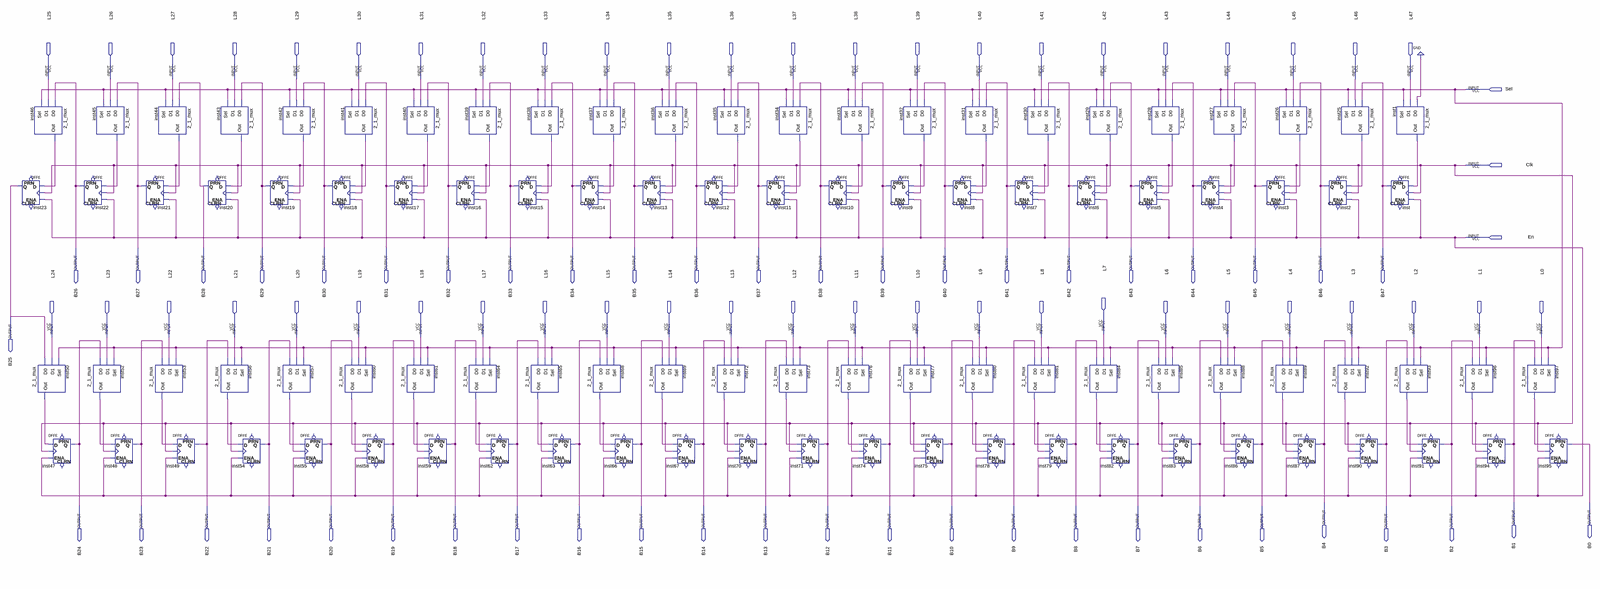
[diagram p0: schematic sheet, whole]
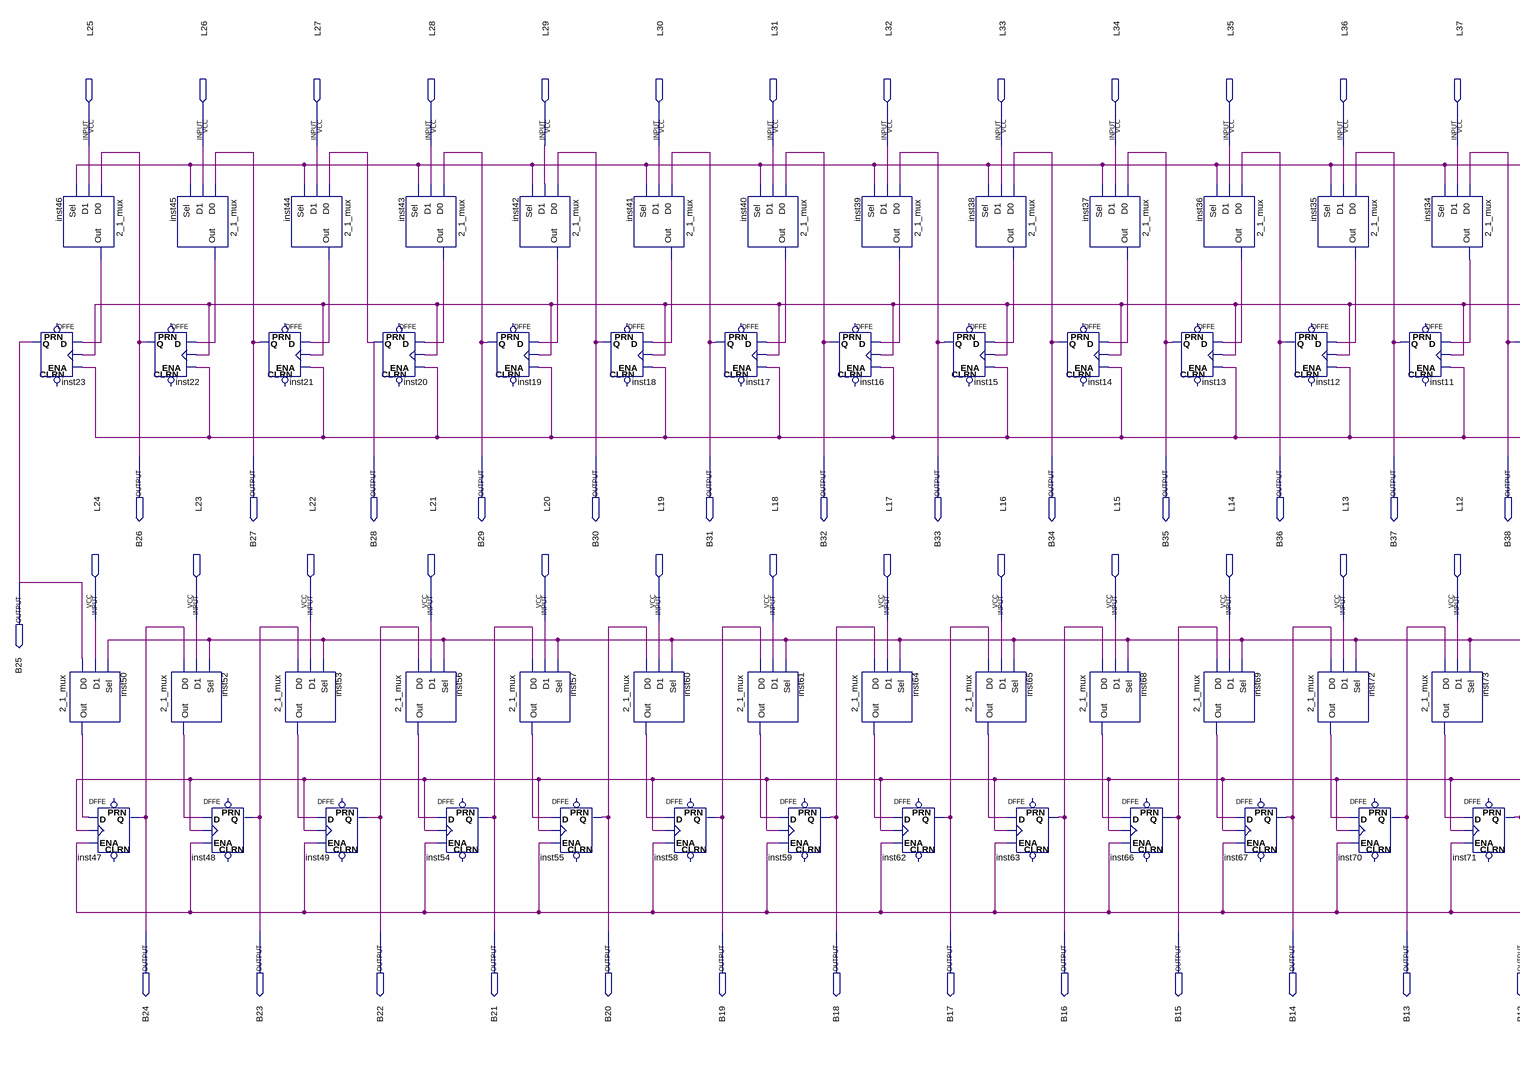
[diagram p1: schematic sheet, left part]
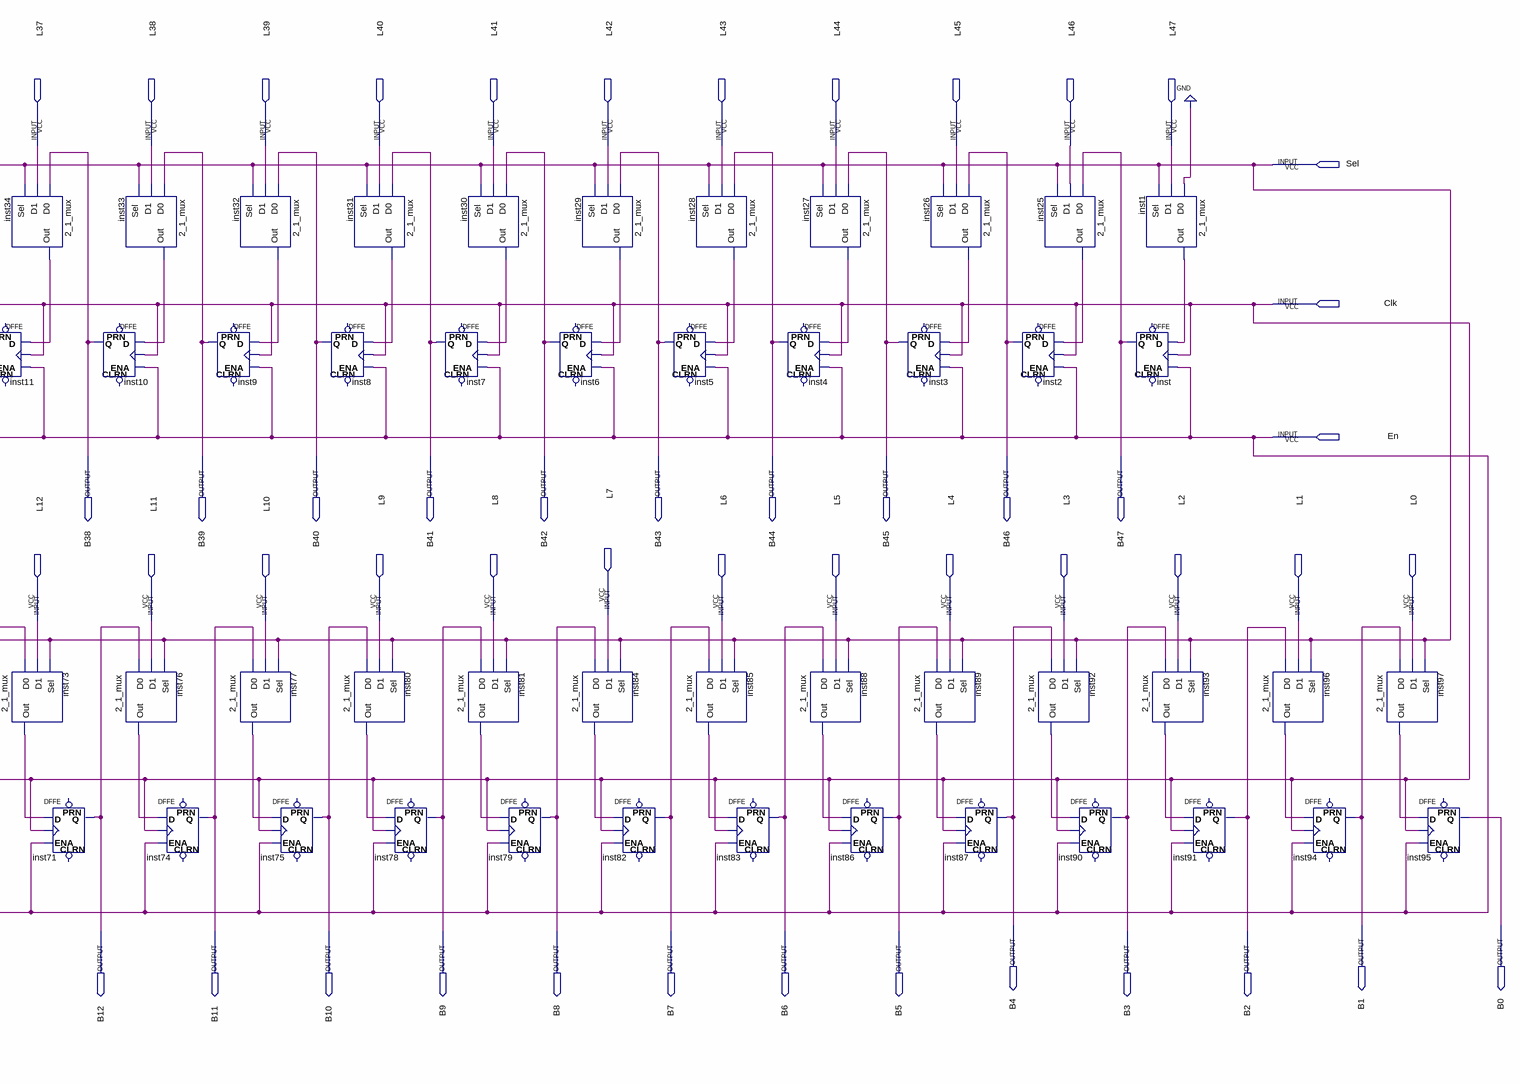
[diagram p2: schematic sheet, right part]
// Quartus schematic 48_bit_par_in_ser_par_out_reg_r.bdf as structural Verilog: 96 symbols, 99 pins
module \48_bit_par_in_ser_par_out_reg_r  (
  input  L25,
  input  L26,
  input  L27,
  input  L28,
  input  L29,
  input  L30,
  input  L31,
  input  L32,
  input  L33,
  input  L34,
  input  L35,
  input  L36,
  input  L37,
  input  L38,
  input  L39,
  input  L40,
  input  L41,
  input  L42,
  input  L43,
  input  L44,
  input  L45,
  input  L46,
  input  L47,
  input  Sel,
  input  Clk,
  input  En,
  input  L7,
  input  L24,
  input  L23,
  input  L22,
  input  L21,
  input  L20,
  input  L19,
  input  L18,
  input  L17,
  input  L16,
  input  L15,
  input  L14,
  input  L13,
  input  L12,
  input  L11,
  input  L10,
  input  L9,
  input  L8,
  input  L6,
  input  L5,
  input  L4,
  input  L3,
  input  L2,
  input  L1,
  input  L0,
  output B26,
  output B27,
  output B28,
  output B29,
  output B30,
  output B31,
  output B32,
  output B33,
  output B34,
  output B35,
  output B36,
  output B37,
  output B38,
  output B39,
  output B40,
  output B41,
  output B42,
  output B43,
  output B44,
  output B45,
  output B46,
  output B47,
  output B25,
  output B4,
  output B1,
  output B0,
  output B24,
  output B23,
  output B22,
  output B21,
  output B20,
  output B19,
  output B18,
  output B17,
  output B16,
  output B15,
  output B14,
  output B13,
  output B12,
  output B11,
  output B10,
  output B9,
  output B8,
  output B7,
  output B6,
  output B5,
  output B3,
  output B2
);

  wire inst1_out, inst25_out, inst26_out, inst27_out, inst28_out, inst29_out, inst30_out, inst31_out,
       inst32_out, inst33_out, inst34_out, inst35_out, inst36_out, inst37_out, inst38_out, inst39_out,
       inst40_out, inst41_out, inst42_out, inst43_out, inst44_out, inst45_out, inst46_out, inst50_out,
       inst52_out, inst53_out, inst56_out, inst57_out, inst60_out, inst61_out, inst64_out, inst65_out,
       inst68_out, inst69_out, inst72_out, inst73_out, inst76_out, inst77_out, inst80_out, inst81_out,
       inst84_out, inst85_out, inst88_out, inst89_out, inst92_out, inst93_out, inst96_out, inst97_out;

  DFFE inst23 (.D(inst46_out), .CLK(Clk), .ENA(En), .Q(B25));  // open: PRN, CLRN
  \2_1_mux  inst46 (.D0(B26), .D1(L25), .Sel(Sel), .Out(inst46_out));
  \2_1_mux  inst50 (.D0(B25), .D1(L24), .Sel(Sel), .Out(inst50_out));
  DFFE inst47 (.D(inst50_out), .CLK(Clk), .ENA(En), .Q(B24));  // open: PRN, CLRN
  DFFE inst22 (.D(inst45_out), .CLK(Clk), .ENA(En), .Q(B26));  // open: PRN, CLRN
  \2_1_mux  inst45 (.D0(B27), .D1(L26), .Sel(Sel), .Out(inst45_out));
  \2_1_mux  inst52 (.D0(B24), .D1(L23), .Sel(Sel), .Out(inst52_out));
  DFFE inst48 (.D(inst52_out), .CLK(Clk), .ENA(En), .Q(B23));  // open: PRN, CLRN
  \2_1_mux  inst44 (.D0(B28), .D1(L27), .Sel(Sel), .Out(inst44_out));
  DFFE inst21 (.D(inst44_out), .CLK(Clk), .ENA(En), .Q(B27));  // open: PRN, CLRN
  \2_1_mux  inst53 (.D0(B23), .D1(L22), .Sel(Sel), .Out(inst53_out));
  DFFE inst49 (.D(inst53_out), .CLK(Clk), .ENA(En), .Q(B22));  // open: PRN, CLRN
  \2_1_mux  inst43 (.D0(B29), .D1(L28), .Sel(Sel), .Out(inst43_out));
  DFFE inst20 (.D(inst43_out), .CLK(Clk), .ENA(En), .Q(B28));  // open: PRN, CLRN
  \2_1_mux  inst56 (.D0(B22), .D1(L21), .Sel(Sel), .Out(inst56_out));
  DFFE inst54 (.D(inst56_out), .CLK(Clk), .ENA(En), .Q(B21));  // open: PRN, CLRN
  DFFE inst19 (.D(inst42_out), .CLK(Clk), .ENA(En), .Q(B29));  // open: PRN, CLRN
  \2_1_mux  inst42 (.D0(B30), .D1(L29), .Sel(Sel), .Out(inst42_out));
  \2_1_mux  inst57 (.D0(B21), .D1(L20), .Sel(Sel), .Out(inst57_out));
  DFFE inst55 (.D(inst57_out), .CLK(Clk), .ENA(En), .Q(B20));  // open: PRN, CLRN
  DFFE inst18 (.D(inst41_out), .CLK(Clk), .ENA(En), .Q(B30));  // open: PRN, CLRN
  \2_1_mux  inst41 (.D0(B31), .D1(L30), .Sel(Sel), .Out(inst41_out));
  \2_1_mux  inst60 (.D0(B20), .D1(L19), .Sel(Sel), .Out(inst60_out));
  DFFE inst58 (.D(inst60_out), .CLK(Clk), .ENA(En), .Q(B19));  // open: PRN, CLRN
  \2_1_mux  inst40 (.D0(B32), .D1(L31), .Sel(Sel), .Out(inst40_out));
  DFFE inst17 (.D(inst40_out), .CLK(Clk), .ENA(En), .Q(B31));  // open: PRN, CLRN
  \2_1_mux  inst61 (.D0(B19), .D1(L18), .Sel(Sel), .Out(inst61_out));
  DFFE inst59 (.D(inst61_out), .CLK(Clk), .ENA(En), .Q(B18));  // open: PRN, CLRN
  \2_1_mux  inst39 (.D0(B33), .D1(L32), .Sel(Sel), .Out(inst39_out));
  DFFE inst16 (.D(inst39_out), .CLK(Clk), .ENA(En), .Q(B32));  // open: PRN, CLRN
  \2_1_mux  inst64 (.D0(B18), .D1(L17), .Sel(Sel), .Out(inst64_out));
  DFFE inst62 (.D(inst64_out), .CLK(Clk), .ENA(En), .Q(B17));  // open: PRN, CLRN
  DFFE inst15 (.D(inst38_out), .CLK(Clk), .ENA(En), .Q(B33));  // open: PRN, CLRN
  \2_1_mux  inst38 (.D0(B34), .D1(L33), .Sel(Sel), .Out(inst38_out));
  \2_1_mux  inst65 (.D0(B17), .D1(L16), .Sel(Sel), .Out(inst65_out));
  DFFE inst63 (.D(inst65_out), .CLK(Clk), .ENA(En), .Q(B16));  // open: PRN, CLRN
  DFFE inst14 (.D(inst37_out), .CLK(Clk), .ENA(En), .Q(B34));  // open: PRN, CLRN
  \2_1_mux  inst37 (.D0(B35), .D1(L34), .Sel(Sel), .Out(inst37_out));
  \2_1_mux  inst68 (.D0(B16), .D1(L15), .Sel(Sel), .Out(inst68_out));
  DFFE inst66 (.D(inst68_out), .CLK(Clk), .ENA(En), .Q(B15));  // open: PRN, CLRN
  \2_1_mux  inst36 (.D0(B36), .D1(L35), .Sel(Sel), .Out(inst36_out));
  DFFE inst13 (.D(inst36_out), .CLK(Clk), .ENA(En), .Q(B35));  // open: PRN, CLRN
  \2_1_mux  inst69 (.D0(B15), .D1(L14), .Sel(Sel), .Out(inst69_out));
  DFFE inst67 (.D(inst69_out), .CLK(Clk), .ENA(En), .Q(B14));  // open: PRN, CLRN
  \2_1_mux  inst35 (.D0(B37), .D1(L36), .Sel(Sel), .Out(inst35_out));
  DFFE inst12 (.D(inst35_out), .CLK(Clk), .ENA(En), .Q(B36));  // open: PRN, CLRN
  \2_1_mux  inst72 (.D0(B14), .D1(L13), .Sel(Sel), .Out(inst72_out));
  DFFE inst70 (.D(inst72_out), .CLK(Clk), .ENA(En), .Q(B13));  // open: PRN, CLRN
  DFFE inst11 (.D(inst34_out), .CLK(Clk), .ENA(En), .Q(B37));  // open: PRN, CLRN
  \2_1_mux  inst34 (.D0(B38), .D1(L37), .Sel(Sel), .Out(inst34_out));
  \2_1_mux  inst73 (.D0(B13), .D1(L12), .Sel(Sel), .Out(inst73_out));
  DFFE inst71 (.D(inst73_out), .CLK(Clk), .ENA(En), .Q(B12));  // open: PRN, CLRN
  DFFE inst10 (.D(inst33_out), .CLK(Clk), .ENA(En), .Q(B38));  // open: PRN, CLRN
  \2_1_mux  inst33 (.D0(B39), .D1(L38), .Sel(Sel), .Out(inst33_out));
  \2_1_mux  inst76 (.D0(B12), .D1(L11), .Sel(Sel), .Out(inst76_out));
  DFFE inst74 (.D(inst76_out), .CLK(Clk), .ENA(En), .Q(B11));  // open: PRN, CLRN
  \2_1_mux  inst32 (.D0(B40), .D1(L39), .Sel(Sel), .Out(inst32_out));
  DFFE inst9 (.D(inst32_out), .CLK(Clk), .ENA(En), .Q(B39));  // open: PRN, CLRN
  \2_1_mux  inst77 (.D0(B11), .D1(L10), .Sel(Sel), .Out(inst77_out));
  DFFE inst75 (.D(inst77_out), .CLK(Clk), .ENA(En), .Q(B10));  // open: PRN, CLRN
  \2_1_mux  inst31 (.D0(B41), .D1(L40), .Sel(Sel), .Out(inst31_out));
  DFFE inst8 (.D(inst31_out), .CLK(Clk), .ENA(En), .Q(B40));  // open: PRN, CLRN
  \2_1_mux  inst80 (.D0(B10), .D1(L9), .Sel(Sel), .Out(inst80_out));
  DFFE inst78 (.D(inst80_out), .CLK(Clk), .ENA(En), .Q(B9));  // open: PRN, CLRN
  DFFE inst7 (.D(inst30_out), .CLK(Clk), .ENA(En), .Q(B41));  // open: PRN, CLRN
  \2_1_mux  inst30 (.D0(B42), .D1(L41), .Sel(Sel), .Out(inst30_out));
  \2_1_mux  inst81 (.D0(B9), .D1(L8), .Sel(Sel), .Out(inst81_out));
  DFFE inst79 (.D(inst81_out), .CLK(Clk), .ENA(En), .Q(B8));  // open: PRN, CLRN
  DFFE inst6 (.D(inst29_out), .CLK(Clk), .ENA(En), .Q(B42));  // open: PRN, CLRN
  \2_1_mux  inst29 (.D0(B43), .D1(L42), .Sel(Sel), .Out(inst29_out));
  \2_1_mux  inst84 (.D0(B8), .D1(L7), .Sel(Sel), .Out(inst84_out));
  DFFE inst82 (.D(inst84_out), .CLK(Clk), .ENA(En), .Q(B7));  // open: PRN, CLRN
  \2_1_mux  inst28 (.D0(B44), .D1(L43), .Sel(Sel), .Out(inst28_out));
  DFFE inst5 (.D(inst28_out), .CLK(Clk), .ENA(En), .Q(B43));  // open: PRN, CLRN
  \2_1_mux  inst85 (.D0(B7), .D1(L6), .Sel(Sel), .Out(inst85_out));
  DFFE inst83 (.D(inst85_out), .CLK(Clk), .ENA(En), .Q(B6));  // open: PRN, CLRN
  \2_1_mux  inst27 (.D0(B45), .D1(L44), .Sel(Sel), .Out(inst27_out));
  DFFE inst4 (.D(inst27_out), .CLK(Clk), .ENA(En), .Q(B44));  // open: PRN, CLRN
  \2_1_mux  inst88 (.D0(B6), .D1(L5), .Sel(Sel), .Out(inst88_out));
  DFFE inst86 (.D(inst88_out), .CLK(Clk), .ENA(En), .Q(B5));  // open: PRN, CLRN
  DFFE inst3 (.D(inst26_out), .CLK(Clk), .ENA(En), .Q(B45));  // open: PRN, CLRN
  \2_1_mux  inst26 (.D0(B46), .D1(L45), .Sel(Sel), .Out(inst26_out));
  \2_1_mux  inst89 (.D0(B5), .D1(L4), .Sel(Sel), .Out(inst89_out));
  DFFE inst87 (.D(inst89_out), .CLK(Clk), .ENA(En), .Q(B4));  // open: PRN, CLRN
  \2_1_mux  inst25 (.D0(B47), .D1(L46), .Sel(Sel), .Out(inst25_out));
  DFFE inst2 (.D(inst25_out), .CLK(Clk), .ENA(En), .Q(B46));  // open: PRN, CLRN
  \2_1_mux  inst92 (.D0(B4), .D1(L3), .Sel(Sel), .Out(inst92_out));
  DFFE inst90 (.D(inst92_out), .CLK(Clk), .ENA(En), .Q(B3));  // open: PRN, CLRN
  \2_1_mux  inst1 (.D0(1'b0), .D1(L47), .Sel(Sel), .Out(inst1_out));
  DFFE inst (.D(inst1_out), .CLK(Clk), .ENA(En), .Q(B47));  // open: PRN, CLRN
  \2_1_mux  inst93 (.D0(B3), .D1(L2), .Sel(Sel), .Out(inst93_out));
  DFFE inst91 (.D(inst93_out), .CLK(Clk), .ENA(En), .Q(B2));  // open: PRN, CLRN
  \2_1_mux  inst96 (.D0(B2), .D1(L1), .Sel(Sel), .Out(inst96_out));
  DFFE inst94 (.D(inst96_out), .CLK(Clk), .ENA(En), .Q(B1));  // open: PRN, CLRN
  \2_1_mux  inst97 (.D0(B1), .D1(L0), .Sel(Sel), .Out(inst97_out));
  DFFE inst95 (.D(inst97_out), .CLK(Clk), .ENA(En), .Q(B0));  // open: PRN, CLRN
endmodule
